# Altium schematic sheet Sheet1.SchDoc
size A4; SheetNumber: 1; SheetTotal: 4
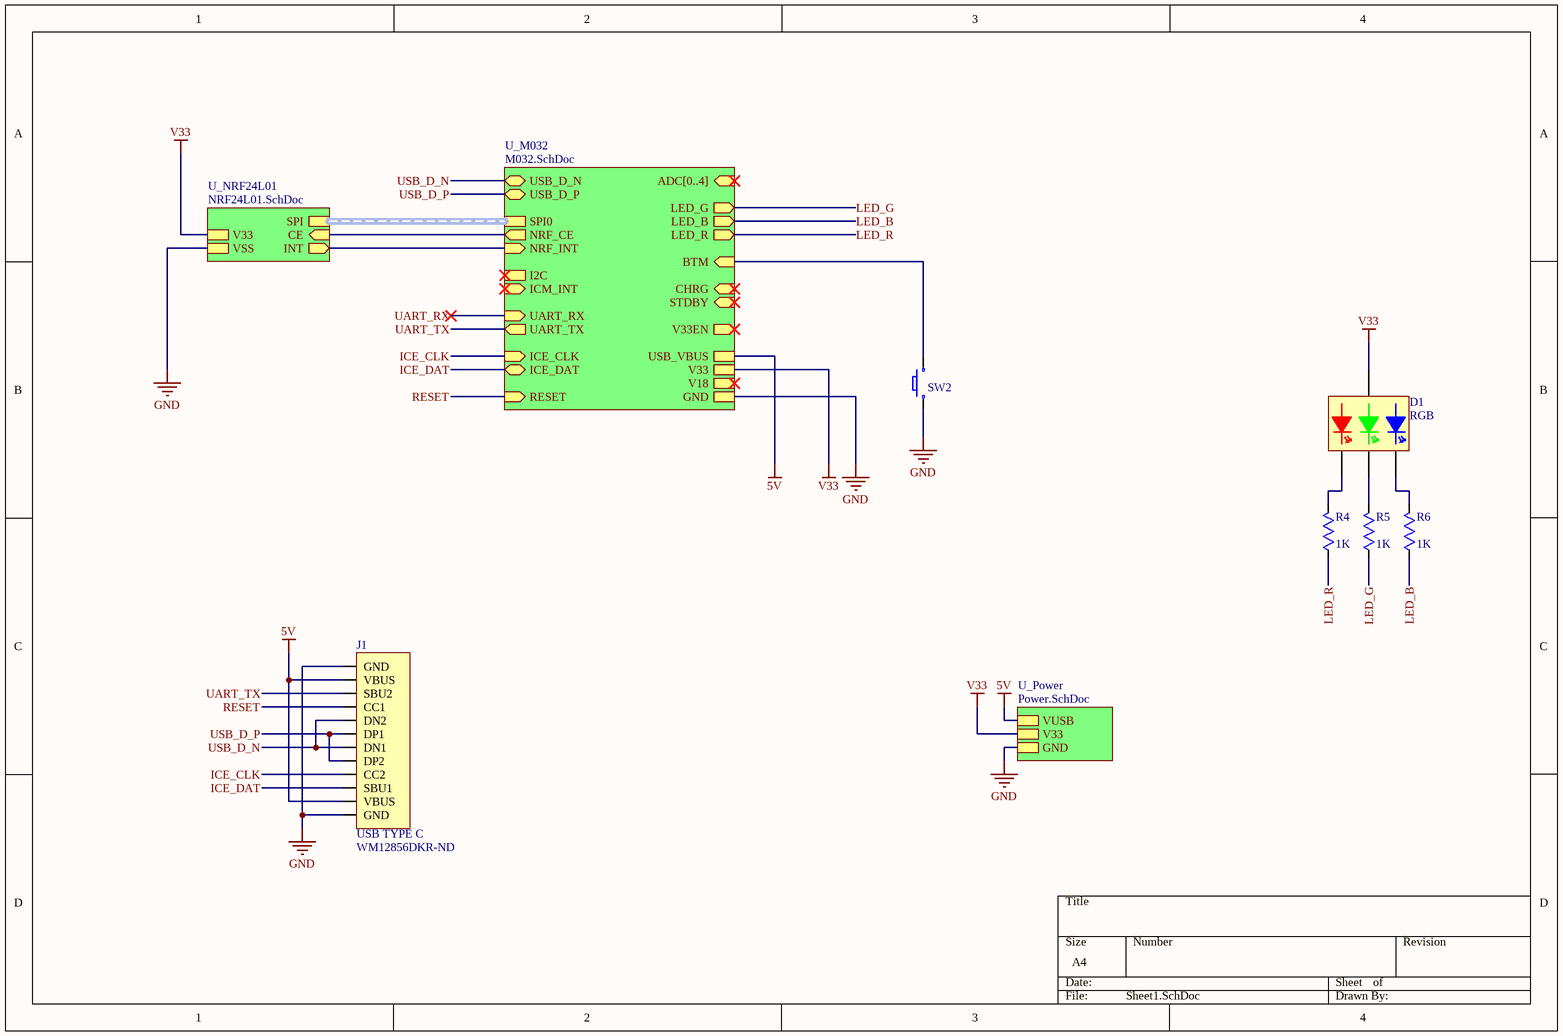
[diagram p0: Sheet1.SchDoc]

## Parts
D1  RGB  [1411_LED]
J1  USB TYPE C  Supplier Part Number 1: WM12856DKR-ND  [USBC-SMD16F]
R4  value 1K  [RES_0402]  (hidden comment: Res)
R5  value 1K  [RES_0402]  (hidden comment: Res)
R6  value 1K  [RES_0402]  (hidden comment: Res)
SW2  SPST  [TACK-SW_SMD 2P 4x3mm_2]  (value not drawn)

## Sub-sheets
U_M032 = M032.SchDoc: ADC[0..4] (in), LED_R (out), LED_G (out), LED_B (out), BTM (in), V33EN (out), CHRG (in), STDBY (in), USB_D_P (bidir), USB_D_N (bidir), NRF_INT (in), ICM_INT (in), SPI0 (harness SPI), I2C (harness I2C), UART_TX (out), UART_RX (in), ICE_CLK (in), ICE_DAT (bidir), RESET (in), V33, V18, GND, NRF_CE (out), USB_VBUS
U_NRF24L01 = NRF24L01.SchDoc: SPI (harness SPI), V33, VSS, INT (out), CE (in)
U_Power = Power.SchDoc: V33, GND, VUSB

## Nets
5V: J1.2(VBUS) J1.11(VBUS) ; sheet U_M032/USB_VBUS, sheet U_Power/VUSB
GND: J1.1(GND) J1.12(GND) SW2.2 ; sheet U_M032/GND, sheet U_NRF24L01/VSS, sheet U_Power/GND
V33: D1.1(Anode) ; sheet U_M032/V33, sheet U_NRF24L01/V33, sheet U_Power/V33
ICE_CLK: J1.9(CC2) ; sheet U_M032/ICE_CLK
ICE_DAT: J1.10(SBU1) ; sheet U_M032/ICE_DAT
LED_B: R6.2 ; sheet U_M032/LED_B
LED_G: R5.2 ; sheet U_M032/LED_G
LED_R: R4.2 ; sheet U_M032/LED_R
RESET: J1.4(CC1) ; sheet U_M032/RESET
UART_RX: sheet U_M032/UART_RX
UART_TX: J1.3(SBU2) ; sheet U_M032/UART_TX
USB_D_N: J1.5(DN2) J1.7(DN1) ; sheet U_M032/USB_D_N
USB_D_P: J1.6(DP1) J1.8(DP2) ; sheet U_M032/USB_D_P
NetD1_2: D1.2(B) R6.1
NetD1_3: D1.3(R) R4.1
NetD1_4: D1.4(G) R5.1
NetSW2_1: SW2.1 ; sheet U_M032/BTM
(unnamed): sheet U_M032/NRF_INT, sheet U_NRF24L01/INT
(unnamed): sheet U_M032/NRF_CE, sheet U_NRF24L01/CE

## Buses and harness runs
harness sheet U_M032/SPI0 = sheet U_NRF24L01/SPI

## Library data of the parts
D1 = LED_1411
J1 = USB TYPE C: USB Shielded I/O Receptacle; Type C; Right Angle; Surface Mount; Gold over Nickel; Manufacturer: Molex; Manufacturer Part Number: 105450-0101; Number of Contacts: 24; Current Rating: 5A; Mating Cycles: 10000; USB Standard: USB 3.1; Number of Ports: 1; Pitch: 0.5mm; Supplier 1: Digi-Key; RoHS: Yes; Category: Connectors; Stock 1: 21711; Pricing 1: 1=2.15000, 10=1.94900, 25=1.82960, 50=1.75000, 100=1.67050, 250=1.51140, 500=1.39208 (USD); Mount: Surface Mount,Through Hole,Horizontal; Case/Package: 0101; Number of Pins: 24; Contact Plating: Gold; Contact Material: Copper Alloy; Housing Material: Thermoplastic; Insulation Color: Black; Number of Terminals: 24; Min Operating Temperature: -30°C; Max Operating Temperature: 85°C; Packaging: Tape and Reel; Gender: Receptacle; Connector Type: USB; Orientation: Right Angle; Termination: Solder; Shielding: Shielded; Features: Shielded; Length: 8.94mm; REACH SVHC: Unknown; Flammability Rating: UL94 V-0; ComponentLink1URL: http://www.farnell.com/datasheets/2801634.pdf?src-supplier=Farnell; ComponentLink1Description: http://www.farnell.com/datasheets/2801634.pdf?src-supplier=Farnell; ComponentLink2URL: http://www.farnell.com/datasheets/2672741.pdf?src-supplier=Newark; ComponentLink2Description: http://www.farnell.com/datasheets/2672741.pdf?src-supplier=Newark; ComponentLink3URL: http://www.farnell.com/datasheets/2015275.pdf?src-supplier=Element14; ComponentLink3Description: http://www.farnell.com/datasheets/2015275.pdf?src-supplier=Element14; ComponentLink4URL: https://www.molex.com/pdm_docs/ps/PS-105448-001.pdf?src-supplier=Digi-Key; ComponentLink4Description: https://www.molex.com/pdm_docs/ps/PS-105448-001.pdf?src-supplier=Digi-Key; ComponentLink5URL: http://www.farnell.com/datasheets/2801634.pdf?src-supplier=Newark; ComponentLink5Description: http://www.farnell.com/datasheets/2801634.pdf?src-supplier=Newark; ComponentLink6URL: https://www.molex.com/pdm_docs/sd/1054500101_sd.pdf?src-supplier=Digi-Key; ComponentLink6Description: https://www.molex.com/pdm_docs/sd/1054500101_sd.pdf?src-supplier=Digi-Key; ComponentLink7URL: http://www.farnell.com/datasheets/2801634.pdf?src-supplier=Element14; ComponentLink7Description: http://www.farnell.com/datasheets/2801634.pdf?src-supplier=Element14; ComponentLink8URL: http://www.literature.molex.com/SQLImages/kelmscott/Molex/PDF_Images/987651-4081.PDF?src-supplier=Avnet; ComponentLink8Description: http://www.literature.molex.com/SQLImages/kelmscott/Molex/PDF_Images/987651-4081.PDF?src-supplier=Avnet; ComponentLink9URL: http://www.literature.molex.com/SQLImages/kelmscott/Molex/PDF_Images/987651-4081.PDF?src-supplier=Avnet+Asia; ComponentLink9Description: http://www.literature.molex.com/SQLImages/kelmscott/Molex/PDF_Images/987651-4081.PDF?src-supplier=Avnet+Asia
SW2 = Switch_Button1